# EAGLE design BartendingRobotPCB (EAGLE 9.6.2)
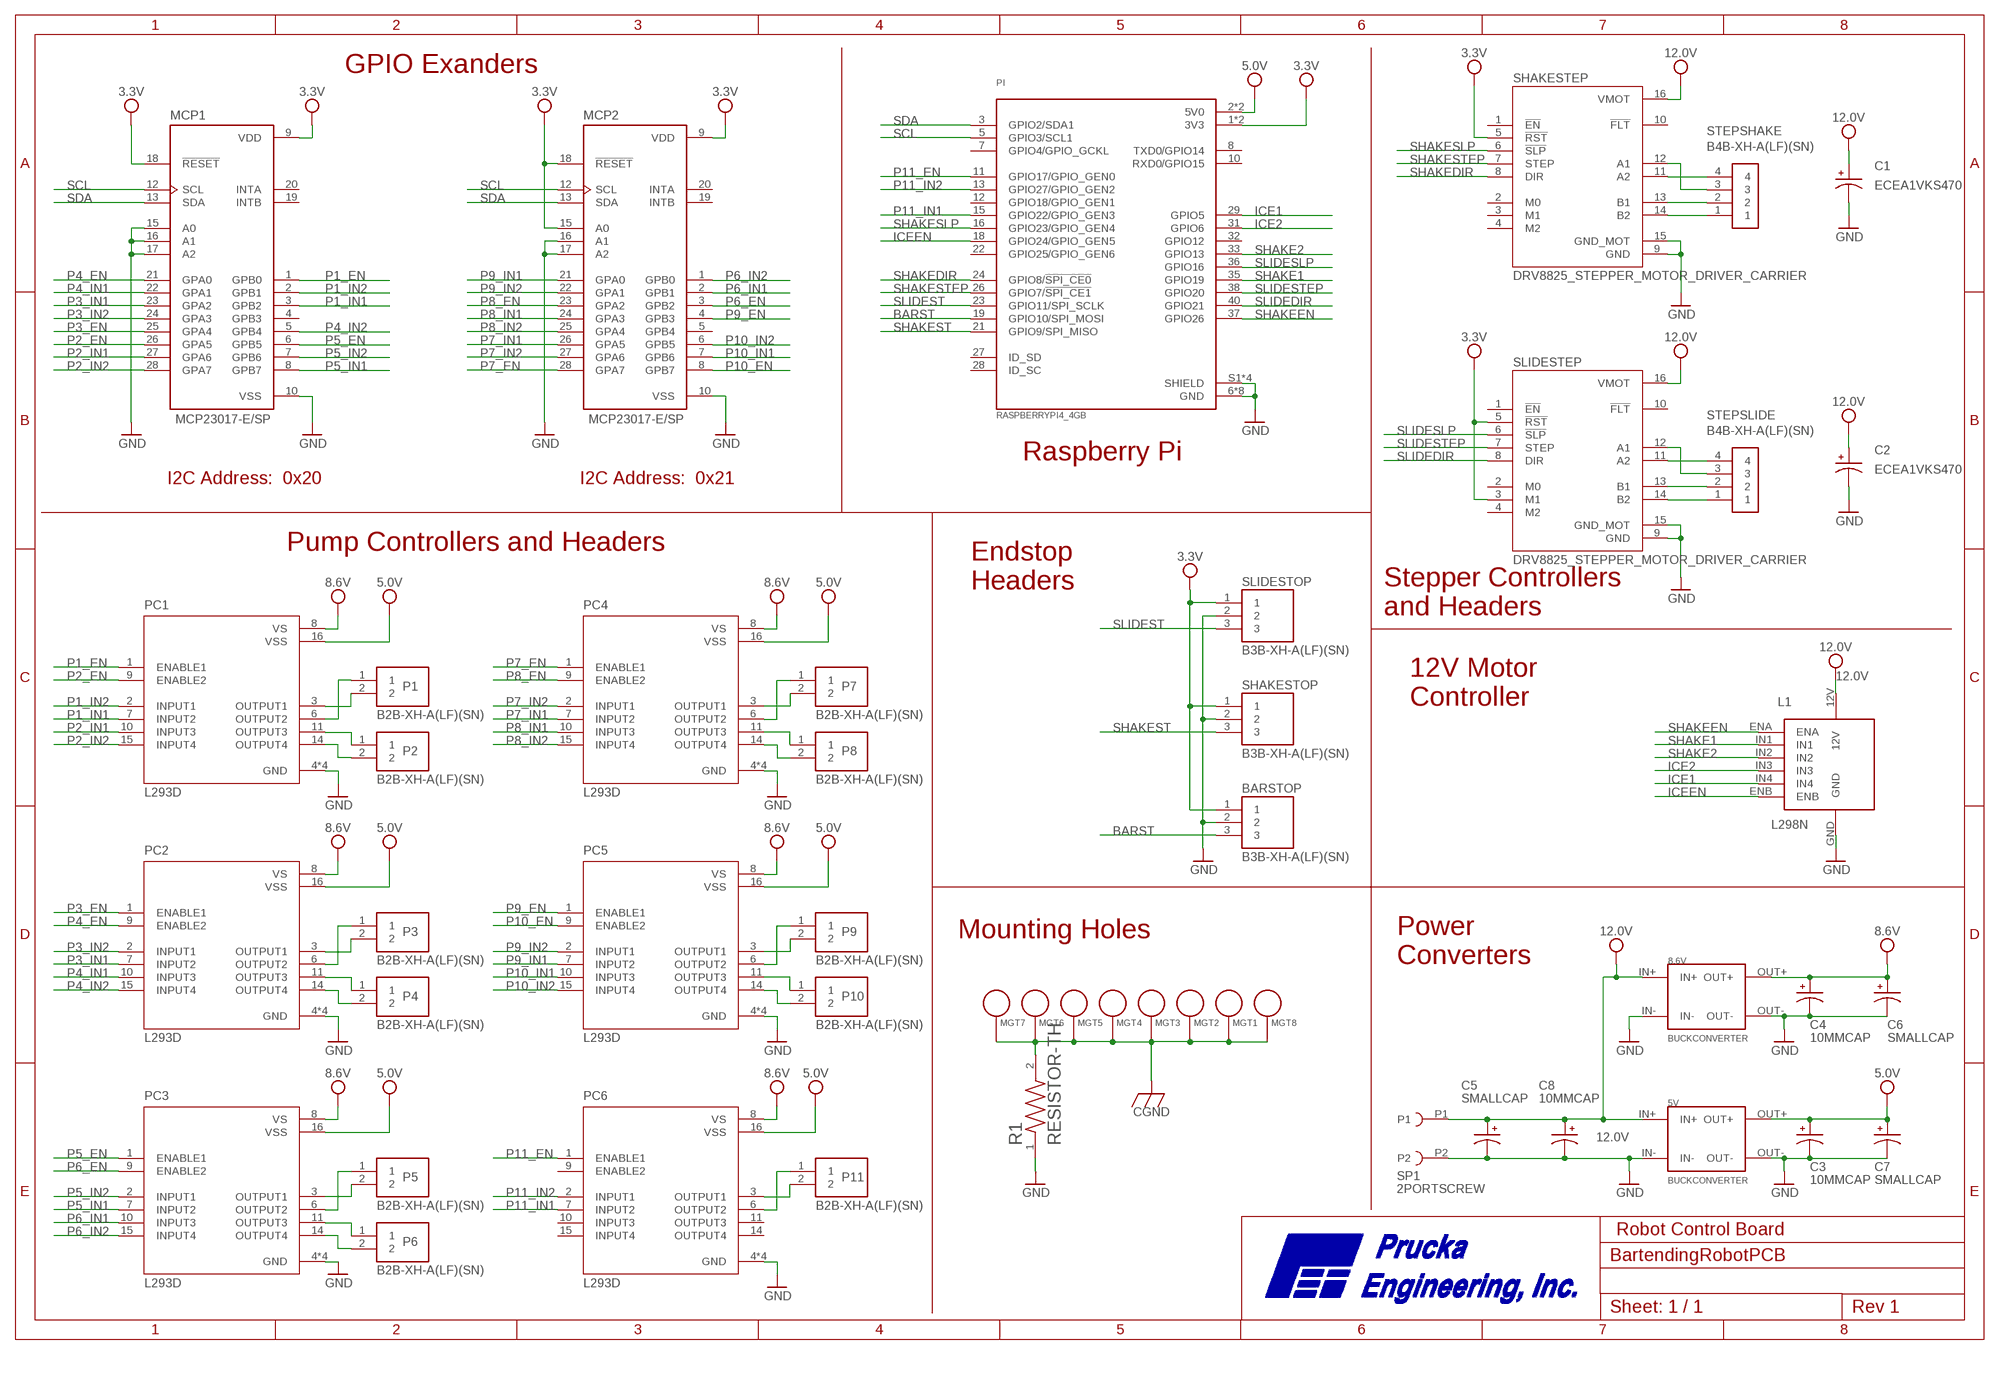
[diagram p0: schematic, sheet 1]

## Parts
5V  BUCKCONVERTER  [BUCKCONVERTER]
8.6V  BUCKCONVERTER  [BUCKCONVERTER]
BARSTOP  B3B-XH-A(LF)(SN)  [JST_B3B-XH-A(LF)(SN)]
C1  ECEA1VKS470  [CAPPRD250W45D800H500]
C2  ECEA1VKS470  [CAPPRD250W45D800H500]
C3  10MMCAP  [10MMCAP]
C4  10MMCAP  [10MMCAP]
C5  SMALLCAP  [SMALLCAP]
C6  SMALLCAP  [SMALLCAP]
C7  SMALLCAP  [SMALLCAP]
C8  10MMCAP  [10MMCAP]
L1  L298N  [L298N]
MCP1  MCP23017-E/SP  [DIP787W45P254L3556H508Q28]
MCP2  MCP23017-E/SP  [DIP787W45P254L3556H508Q28]
MGT1  MOUNTING_HOLE  [MOUNTING_HOLE]
MGT2  MOUNTING_HOLE  [MOUNTING_HOLE]
MGT3  MOUNTING_HOLE  [MOUNTING_HOLE]
MGT4  MOUNTING_HOLE  [MOUNTING_HOLE]
MGT5  MOUNTING_HOLE  [MOUNTING_HOLE]
MGT6  MOUNTING_HOLE  [MOUNTING_HOLE]
MGT7  MOUNTING_HOLE  [MOUNTING_HOLE]
MGT8  MOUNTING_HOLE  [MOUNTING_HOLE]
P1  B2B-XH-A(LF)(SN)  [JST_B2B-XH-A(LF)(SN)]
P2  B2B-XH-A(LF)(SN)  [JST_B2B-XH-A(LF)(SN)]
P3  B2B-XH-A(LF)(SN)  [JST_B2B-XH-A(LF)(SN)]
P4  B2B-XH-A(LF)(SN)  [JST_B2B-XH-A(LF)(SN)]
P5  B2B-XH-A(LF)(SN)  [JST_B2B-XH-A(LF)(SN)]
P6  B2B-XH-A(LF)(SN)  [JST_B2B-XH-A(LF)(SN)]
P7  B2B-XH-A(LF)(SN)  [JST_B2B-XH-A(LF)(SN)]
P8  B2B-XH-A(LF)(SN)  [JST_B2B-XH-A(LF)(SN)]
P9  B2B-XH-A(LF)(SN)  [JST_B2B-XH-A(LF)(SN)]
P10  B2B-XH-A(LF)(SN)  [JST_B2B-XH-A(LF)(SN)]
P11  B2B-XH-A(LF)(SN)  [JST_B2B-XH-A(LF)(SN)]
PC1  L293D  [DIP880W50P254L2000H510Q16]
PC2  L293D  [DIP880W50P254L2000H510Q16]
PC3  L293D  [DIP880W50P254L2000H510Q16]
PC4  L293D  [DIP880W50P254L2000H510Q16]
PC5  L293D  [DIP880W50P254L2000H510Q16]
PC6  L293D  [DIP880W50P254L2000H510Q16]
PI  RASPBERRYPI4_4GB  [MODULE_RASPBERRYPI4_4GB]
R1  RESISTOR-TH  [RESAD700W45L350D185]
SHAKESTEP  DRV8825_STEPPER_MOTOR_DRIVER_CARRIER  [IC_DRV8825_STEPPER_MOTOR_DRIVER_CARRIER]
SHAKESTOP  B3B-XH-A(LF)(SN)  [JST_B3B-XH-A(LF)(SN)]
SLIDESTEP  DRV8825_STEPPER_MOTOR_DRIVER_CARRIER  [IC_DRV8825_STEPPER_MOTOR_DRIVER_CARRIER]
SLIDESTOP  B3B-XH-A(LF)(SN)  [JST_B3B-XH-A(LF)(SN)]
SP1  2PORTSCREW  [2PORTSCREW]
STEPSHAKE  B4B-XH-A(LF)(SN)  [JST_B4B-XH-A(LF)(SN)]
STEPSLIDE  B4B-XH-A(LF)(SN)  [JST_B4B-XH-A(LF)(SN)]

## Nets
3.3V: BARSTOP.1 MCP1.9(VDD) MCP1.18(!RESET) MCP2.9(VDD) MCP2.15(A0) MCP2.18(!RESET) PI.1(3V3) PI.17(3V3) SHAKESTEP.5(!RST) SHAKESTOP.1 SLIDESTEP.3(M1) SLIDESTEP.5(!RST) SLIDESTOP.1
5.0V: 5V.OUT+ C3.+(P) C7.+(P) PC1.16(VSS) PC2.16(VSS) PC3.16(VSS) PC4.16(VSS) PC5.16(VSS) PC6.16(VSS) PI.2(5V0) PI.4(5V0)
8.6V: 8.6V.OUT+ C4.+(P) C6.+(P) PC1.8(VS) PC2.8(VS) PC3.8(VS) PC4.8(VS) PC5.8(VS) PC6.8(VS)
12.0V: 5V.IN+ 8.6V.IN+ C1.P C2.P C5.+(P) C8.+(P) L1.12V SHAKESTEP.16(VMOT) SLIDESTEP.16(VMOT) SP1.P1
BARST: BARSTOP.3 PI.19(GPIO10/SPI_MOSI)
CGND: MGT1.P$1 MGT2.P$1 MGT3.P$1 MGT4.P$1 MGT5.P$1 MGT6.P$1 MGT7.P$1 MGT8.P$1 R1.2
GND: 5V.IN- 5V.OUT- 8.6V.IN- 8.6V.OUT- BARSTOP.2 C1.N C2.N C3.-(N) C4.-(N) C5.-(N) C6.-(N) C7.-(N) C8.-(N) L1.GND MCP1.10(VSS) MCP1.15(A0) MCP1.16(A1) MCP1.17(A2) MCP2.10(VSS) MCP2.16(A1) MCP2.17(A2) PC1.4(GND) PC1.5(GND) PC1.12(GND) PC1.13(GND) PC2.4(GND) PC2.5(GND) PC2.12(GND) PC2.13(GND) PC3.4(GND) PC3.5(GND) PC3.12(GND) PC3.13(GND) PC4.4(GND) PC4.5(GND) PC4.12(GND) PC4.13(GND) PC5.4(GND) PC5.5(GND) PC5.12(GND) PC5.13(GND) PC6.4(GND) PC6.5(GND) PC6.12(GND) PC6.13(GND) PI.6(GND) PI.9(GND) PI.14(GND) PI.20(GND) PI.25(GND) PI.30(GND) PI.34(GND) PI.39(GND) PI.S1(SHIELD) PI.S2(SHIELD) PI.S3(SHIELD) PI.S4(SHIELD) R1.1 SHAKESTEP.9(GND) SHAKESTEP.15(GND_MOT) SHAKESTOP.2 SLIDESTEP.9(GND) SLIDESTEP.15(GND_MOT) SLIDESTOP.2 SP1.P2
ICE1: L1.IN4 PI.29(GPIO5)
ICE2: L1.IN3 PI.31(GPIO6)
ICEEN: L1.ENB PI.18(GPIO24/GPIO_GEN5)
N$1: SHAKESTEP.14(B2) STEPSHAKE.1
N$2: SHAKESTEP.13(B1) STEPSHAKE.2
N$3: SHAKESTEP.11(A2) STEPSHAKE.4
N$4: SHAKESTEP.12(A1) STEPSHAKE.3
N$5: SLIDESTEP.14(B2) STEPSLIDE.1
N$6: SLIDESTEP.13(B1) STEPSLIDE.2
N$7: SLIDESTEP.11(A2) STEPSLIDE.4
N$8: SLIDESTEP.12(A1) STEPSLIDE.3
N$9: P3.1 PC2.6(OUTPUT2)
N$10: P3.2 PC2.3(OUTPUT1)
N$11: P7.1 PC4.6(OUTPUT2)
N$12: P7.2 PC4.3(OUTPUT1)
N$13: P2.1 PC1.11(OUTPUT3)
N$14: P2.2 PC1.14(OUTPUT4)
N$15: P9.1 PC5.6(OUTPUT2)
N$16: P9.2 PC5.3(OUTPUT1)
N$17: P4.1 PC2.11(OUTPUT3)
N$18: P4.2 PC2.14(OUTPUT4)
N$19: P11.1 PC6.6(OUTPUT2)
N$20: P11.2 PC6.3(OUTPUT1)
N$21: P5.1 PC3.6(OUTPUT2)
N$22: P6.1 PC3.11(OUTPUT3)
N$23: P6.2 PC3.14(OUTPUT4)
N$24: P5.2 PC3.3(OUTPUT1)
N$25: P1.1 PC1.6(OUTPUT2)
N$26: P1.2 PC1.3(OUTPUT1)
N$27: P10.2 PC5.14(OUTPUT4)
N$30: P10.1 PC5.11(OUTPUT3)
N$33: P8.2 PC4.14(OUTPUT4)
N$34: P8.1 PC4.11(OUTPUT3)
P1_EN: MCP1.1(GPB0) PC1.1(ENABLE1)
P1_IN1: MCP1.3(GPB2) PC1.7(INPUT2)
P1_IN2: MCP1.2(GPB1) PC1.2(INPUT1)
P2_EN: MCP1.26(GPA5) PC1.9(ENABLE2)
P2_IN1: MCP1.27(GPA6) PC1.10(INPUT3)
P2_IN2: MCP1.28(GPA7) PC1.15(INPUT4)
P3_EN: MCP1.25(GPA4) PC2.1(ENABLE1)
P3_IN1: MCP1.23(GPA2) PC2.7(INPUT2)
P3_IN2: MCP1.24(GPA3) PC2.2(INPUT1)
P4_EN: MCP1.21(GPA0) PC2.9(ENABLE2)
P4_IN1: MCP1.22(GPA1) PC2.10(INPUT3)
P4_IN2: MCP1.5(GPB4) PC2.15(INPUT4)
P5_EN: MCP1.6(GPB5) PC3.1(ENABLE1)
P5_IN1: MCP1.8(GPB7) PC3.7(INPUT2)
P5_IN2: MCP1.7(GPB6) PC3.2(INPUT1)
P6_EN: MCP2.3(GPB2) PC3.9(ENABLE2)
P6_IN1: MCP2.2(GPB1) PC3.10(INPUT3)
P6_IN2: MCP2.1(GPB0) PC3.15(INPUT4)
P7_EN: MCP2.28(GPA7) PC4.1(ENABLE1)
P7_IN1: MCP2.26(GPA5) PC4.7(INPUT2)
P7_IN2: MCP2.27(GPA6) PC4.2(INPUT1)
P8_EN: MCP2.23(GPA2) PC4.9(ENABLE2)
P8_IN1: MCP2.24(GPA3) PC4.10(INPUT3)
P8_IN2: MCP2.25(GPA4) PC4.15(INPUT4)
P9_EN: MCP2.4(GPB3) PC5.1(ENABLE1)
P9_IN1: MCP2.21(GPA0) PC5.7(INPUT2)
P9_IN2: MCP2.22(GPA1) PC5.2(INPUT1)
P10_EN: MCP2.8(GPB7) PC5.9(ENABLE2)
P10_IN1: MCP2.7(GPB6) PC5.10(INPUT3)
P10_IN2: MCP2.6(GPB5) PC5.15(INPUT4)
P11_EN: PC6.1(ENABLE1) PI.11(GPIO17/GPIO_GEN0)
P11_IN1: PC6.7(INPUT2) PI.15(GPIO22/GPIO_GEN3)
P11_IN2: PC6.2(INPUT1) PI.13(GPIO27/GPIO_GEN2)
SCL: MCP1.12(SCL) MCP2.12(SCL) PI.5(GPIO3/SCL1)
SDA: MCP1.13(SDA) MCP2.13(SDA) PI.3(GPIO2/SDA1)
SHAKE1: L1.IN1 PI.35(GPIO19)
SHAKE2: L1.IN2 PI.33(GPIO13)
SHAKEDIR: PI.24(GPIO8/!SPI_CE0!) SHAKESTEP.8(DIR)
SHAKEEN: L1.ENA PI.37(GPIO26)
SHAKESLP: PI.16(GPIO23/GPIO_GEN4) SHAKESTEP.6(!SLP)
SHAKEST: PI.21(GPIO9/SPI_MISO) SHAKESTOP.3
SHAKESTEP: PI.26(GPIO7/!SPI_CE1!) SHAKESTEP.7(STEP)
SLIDEDIR: PI.40(GPIO21) SLIDESTEP.8(DIR)
SLIDESLP: PI.36(GPIO16) SLIDESTEP.6(!SLP)
SLIDEST: PI.23(GPIO11/SPI_SCLK) SLIDESTOP.3
SLIDESTEP: PI.38(GPIO20) SLIDESTEP.7(STEP)
Unconnected: MCP1.4(GPB3) MCP1.19(INTB) MCP1.20(INTA) MCP2.5(GPB4) MCP2.19(INTB) MCP2.20(INTA) PC6.9(ENABLE2) PC6.10(INPUT3) PC6.11(OUTPUT3) PC6.14(OUTPUT4) PC6.15(INPUT4) PI.7(GPIO4/GPIO_GCKL) PI.8(TXD0/GPIO14) PI.10(RXD0/GPIO15) PI.12(GPIO18/GPIO_GEN1) PI.22(GPIO25/GPIO_GEN6) PI.27(ID_SD) PI.28(ID_SC) PI.32(GPIO12) SHAKESTEP.1(!EN) SHAKESTEP.2(M0) SHAKESTEP.3(M1) SHAKESTEP.4(M2) SHAKESTEP.10(!FLT) SLIDESTEP.1(!EN) SLIDESTEP.2(M0) SLIDESTEP.4(M2) SLIDESTEP.10(!FLT)

## Notes on the sheet
- GPIO Exanders
- Raspberry Pi
- I2C Address:  0x20 | I2C Address:  0x21
- Pump Controllers and Headers
- Endstop 
  Headers
- Stepper Controllers 
  and Headers
- 12V Motor 
  Controller
- Mounting Holes
- Power 
  Converters
- Robot Control Board
- 1 / 1
- C:/Temp/PEI Logo.bmp
- C:/Temp/PEI Logo.bmp

## Library data of the parts
5V 8.6V = BartendingRobot:BUCKCONVERTER: Pin layout for a high amperage buck converter
BARSTOP SHAKESTOP SLIDESTOP = BartendingRobot:B3B-XH-A(LF)(SN): Connector Header Through Hole 3 position 0.098" (2.50mm) Check prices <https://pricing.snapeda.com/parts/B3B-XH-A%28LF%29%28SN%29/JST%20Sales/view-part?ref=eda>; AVAILABILITY: In Stock; DESCRIPTION: Connector Header Through Hole 3 position 0.098 (2.50mm); MF: JST Sales; MP: B3B-XH-A(LF)(SN); PACKAGE: None; PRICE: None
C1 C2 = BartendingRobot:ECEA1VKS470: KS-A; A_MAX: 5; B_MAX: 0.5; B_NOM: 0.45; DESCRIPTION: KS-A; D_NOM: 8; E_NOM: 2.5; MF: PANASONIC; PARTREV: 28-FEB-20
C3 C4 C8 = BartendingRobot:10MMCAP
C5-C7 = BartendingRobot:SMALLCAP
L1 = BartendingRobot:L298N: Mounting for L298N board and logic pins
MCP1 MCP2 = BartendingRobot:MCP23017-E/SP: MCP23017 Series 5.5 V 1.7 MHz SMT 16-Bit I2C I/O Expander - SPDIP-28; MF: Microchip; PARTREV: C; STANDARD: IPC-7251
MGT1-MGT8 = BartendingRobot:MOUNTING_HOLE: Chassis Mounting Hole w/GND connection ability
P1-P11 = BartendingRobot:B2B-XH-A(LF)(SN): Connector Header Through Hole 2 position 0.098" (2.50mm) Check prices <https://pricing.snapeda.com/parts/B2B-XH-A%28LF%29%28SN%29/JST%20Sales/view-part?ref=eda>; AVAILABILITY: In Stock; DESCRIPTION: Connector Header Through Hole 2 position 0.098 (2.50mm); MF: JST Sales; MP: B2B-XH-A(LF)(SN); PACKAGE: None; PRICE: None
PC1-PC6 = BartendingRobot:L293D: 4-Channel Motor Driver 24V 16-Pin Power PDIP Tube; A_MAX: 5.1; A_MIN: 5.1; A_NOM: 5.1; B_MAX: 0.5; B_MIN: 0.5; B_NOM: 0.5; D_MAX: 20.0; D_MIN: 20.0; D_NOM: 20.0; E1_MAX: 7.1; E1_MIN: 7.1; E1_NOM: 7.1; ENOM: 2.54; E_NOM: 8.8; MANUFACTURER: ST Microelectronics; MAXIMUM_PACKAGE_HEIGHT: 5.1mm; PIN_COUNT: 16.0; STANDARD: IPC 7351B
PI = BartendingRobot:RASPBERRYPI4_4GB: BCM2835 Raspberry Pi Model B+ - ARM11, VideoCore MPU Embedded Evaluation Board; MANUFACTURER: Raspberry Pi; MAXIMUM_PACKAGE_HIEGHT: 18mm; PARTREV: 1.0; STANDARD: Manufacturer Recommendations
R1 = BartendingRobot:RESISTOR-TH: CFR16 5% 10K; MANUFACTURER: TE Connectivity; MAXIMUM_PACKAGE_HEIGHT: 3.85mm; PARTREV: BA; STANDARD: Manufacturer Recommendations
SHAKESTEP SLIDESTEP = BartendingRobot:DRV8825_STEPPER_MOTOR_DRIVER_CARRIER: Stepper motor controler; IC: DRV8825; 1.5A; Uin mot: 8.2÷45V; AVAILABILITY: Unavailable; DESCRIPTION: Stepper motor controler; IC: DRV8825; 1.5A; Uin mot: 8.2÷45V; MF: Pololu; MP: DRV8825 STEPPER MOTOR DRIVER CARRIER; PACKAGE: None; PRICE: None
SP1 = BartendingRobot:2PORTSCREW: 2 port screw terminal to connect high power wires to a PCB
STEPSHAKE STEPSLIDE = BartendingRobot:B4B-XH-A(LF)(SN): XH Series 4 Position 2.5 mm Pitch Through Hole Crimp Top Entry Shrouded Header; MANUFACTURER: JST Sales America Inc; PARTREV: NA; STANDARD: Manufacturer Recommendation

## Board
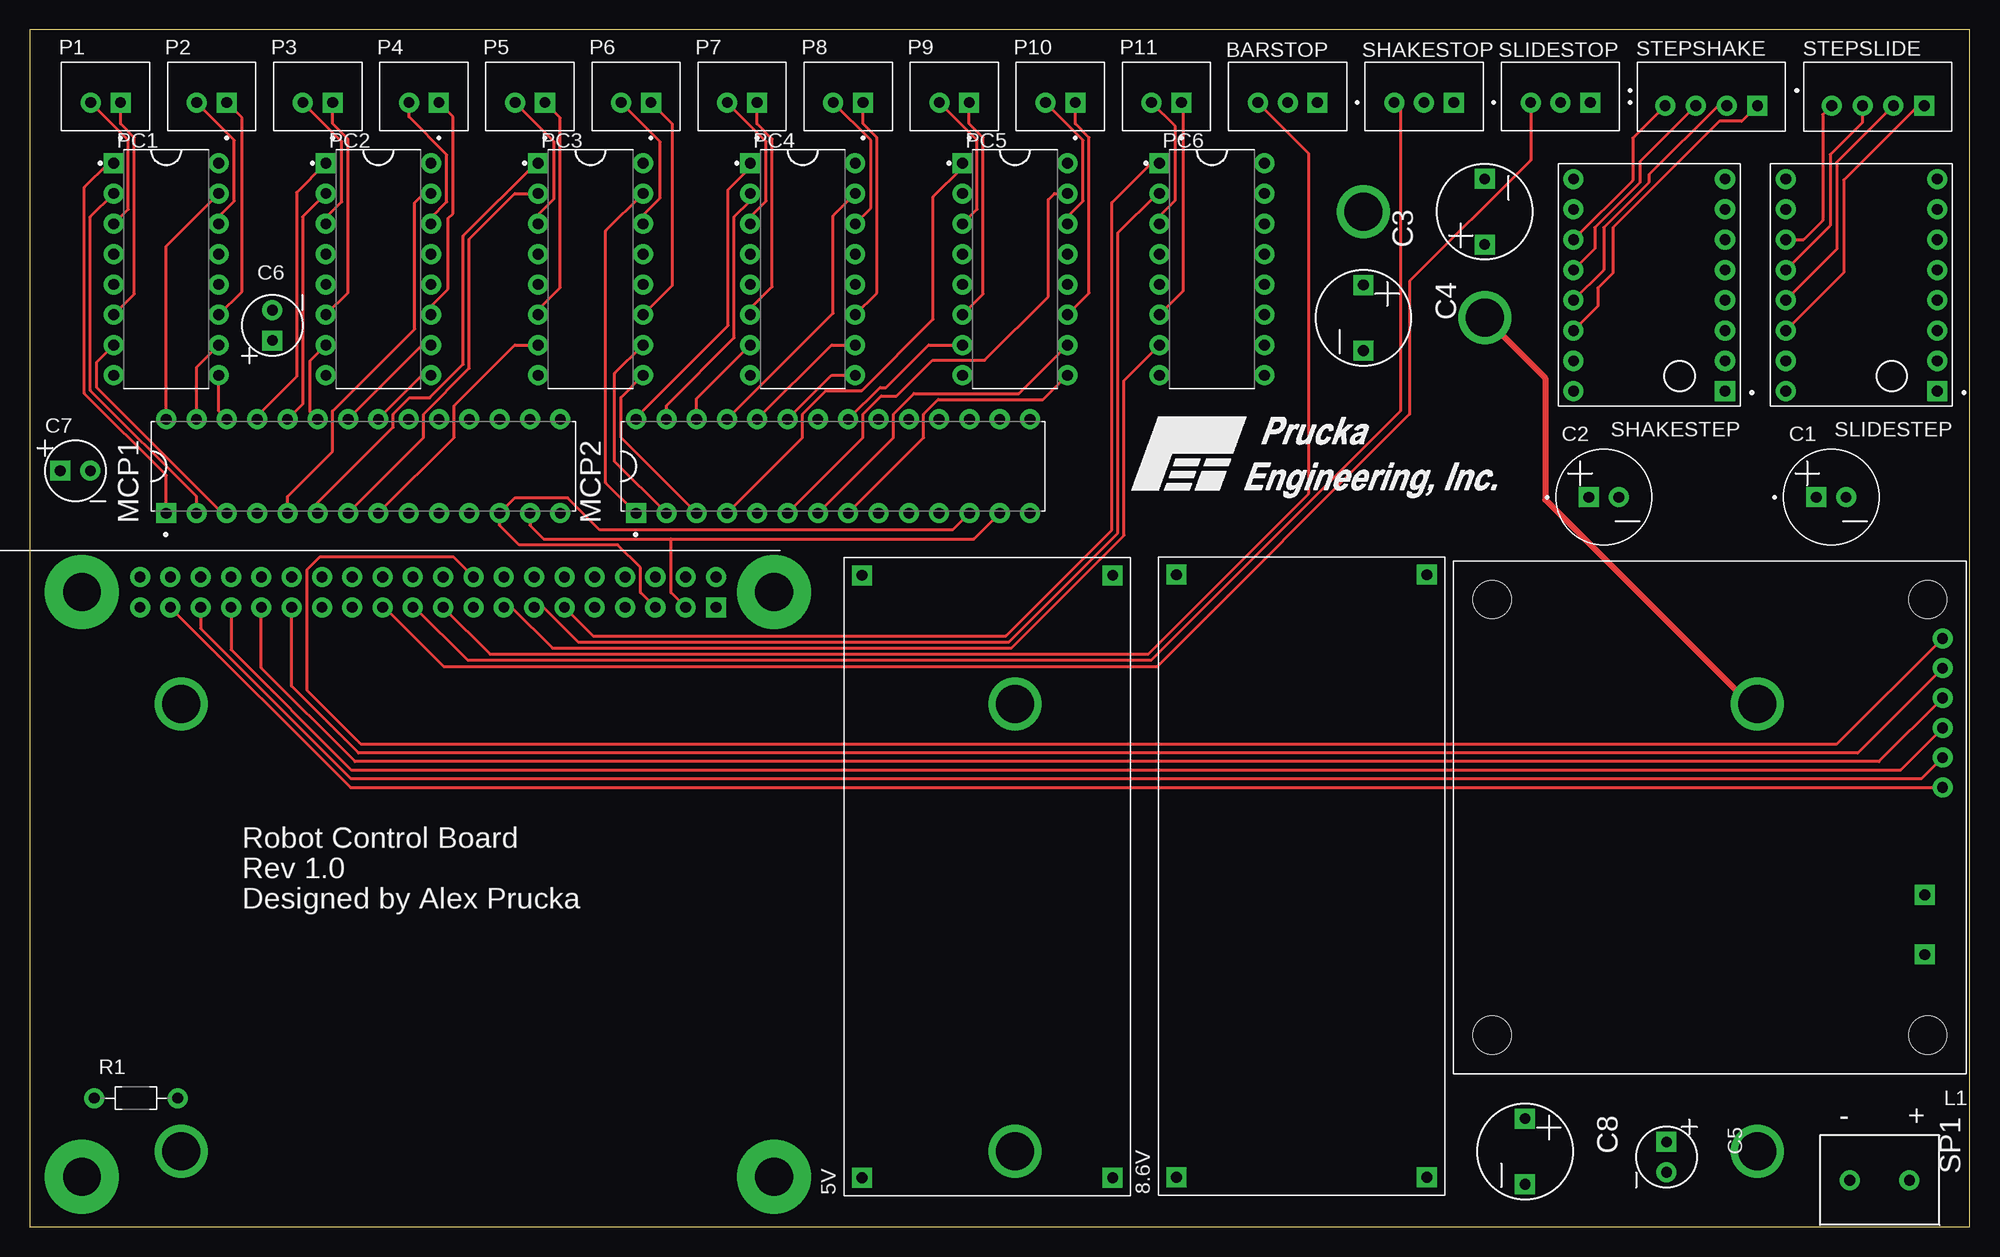
[diagram p1: board, top side]
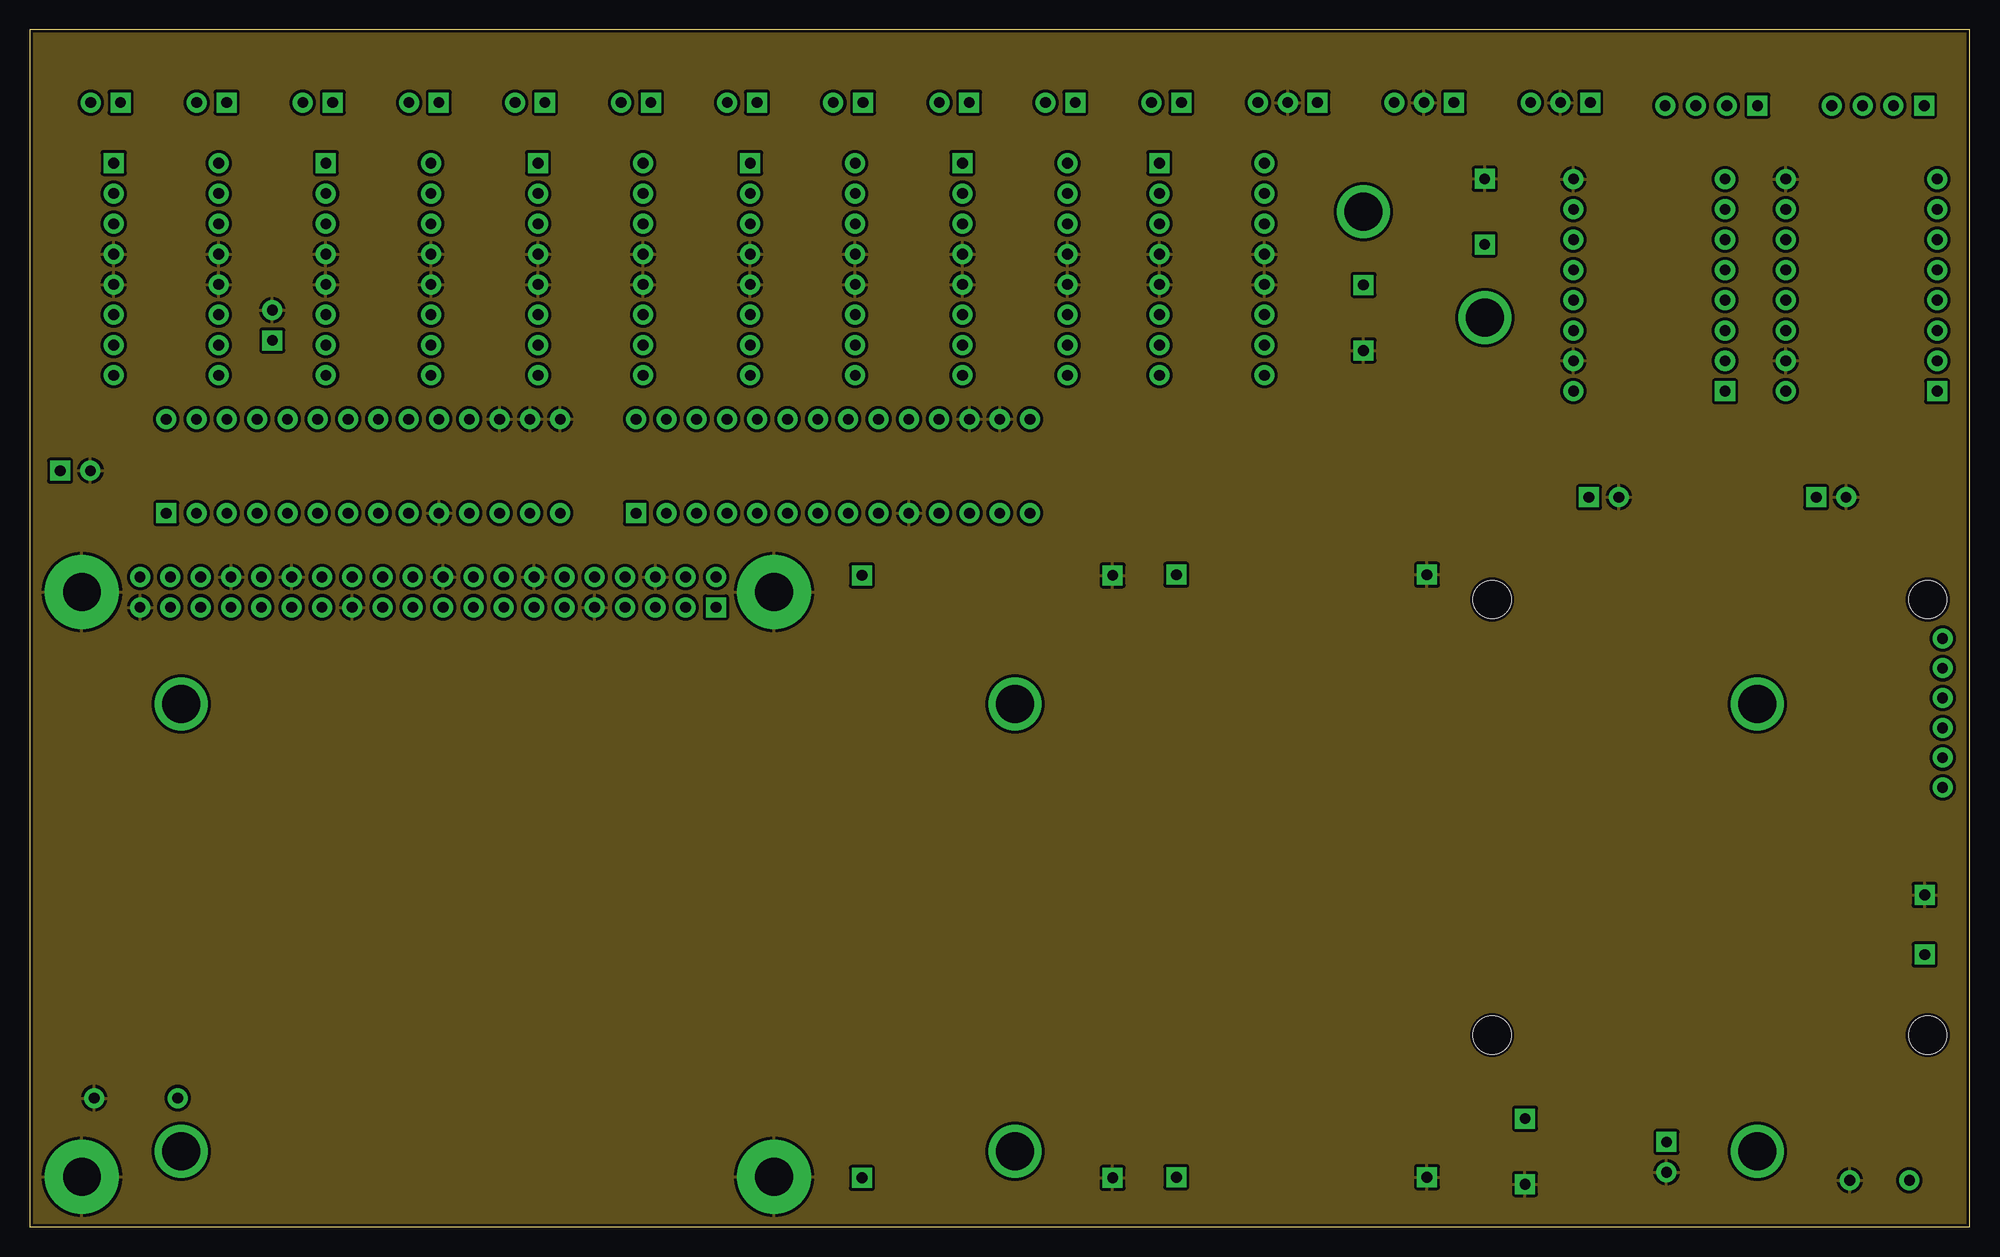
[diagram p2: board, inner layer Route2]
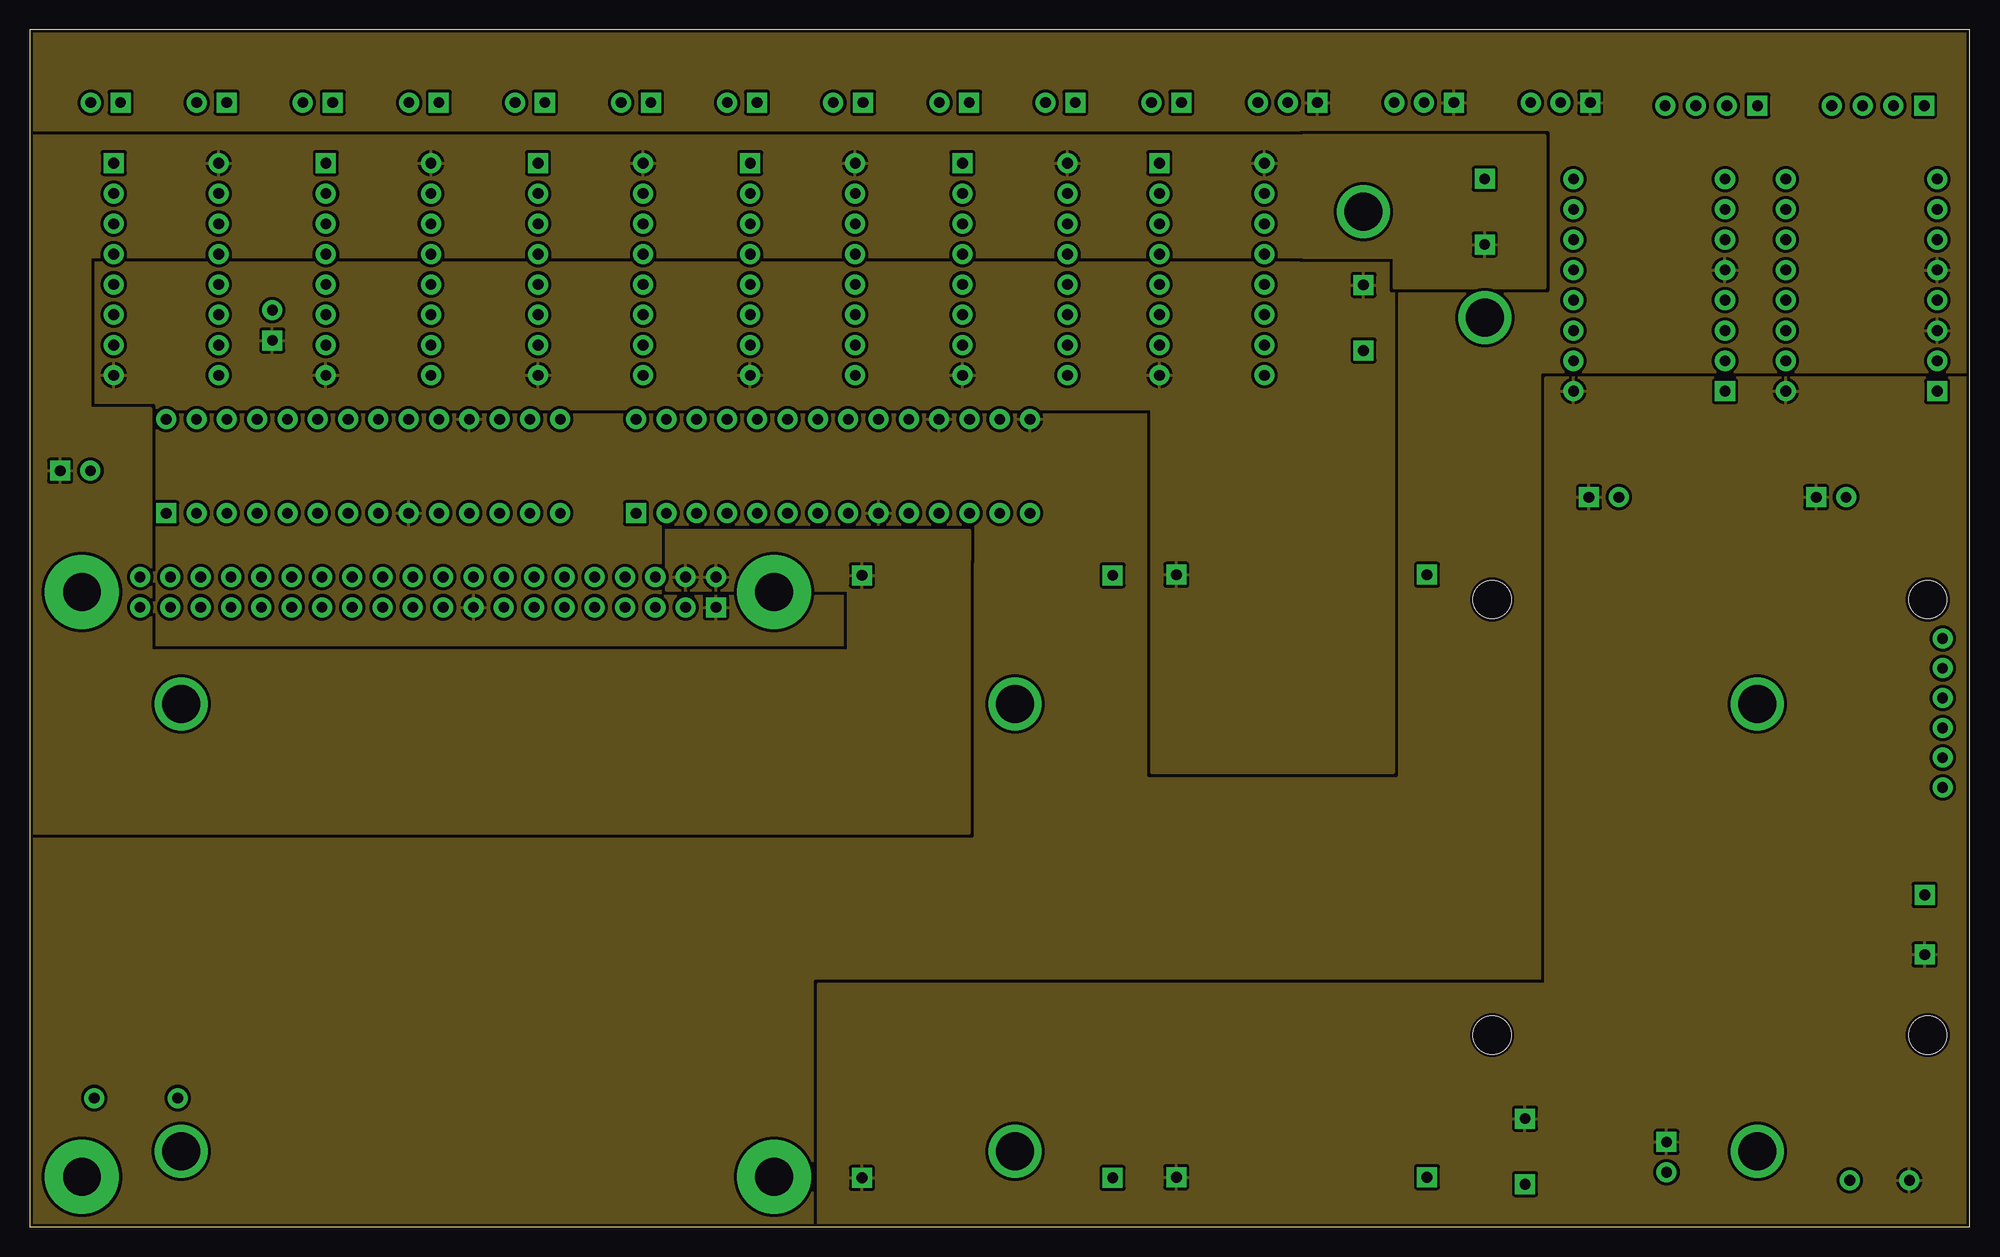
[diagram p3: board, inner layer Route15]
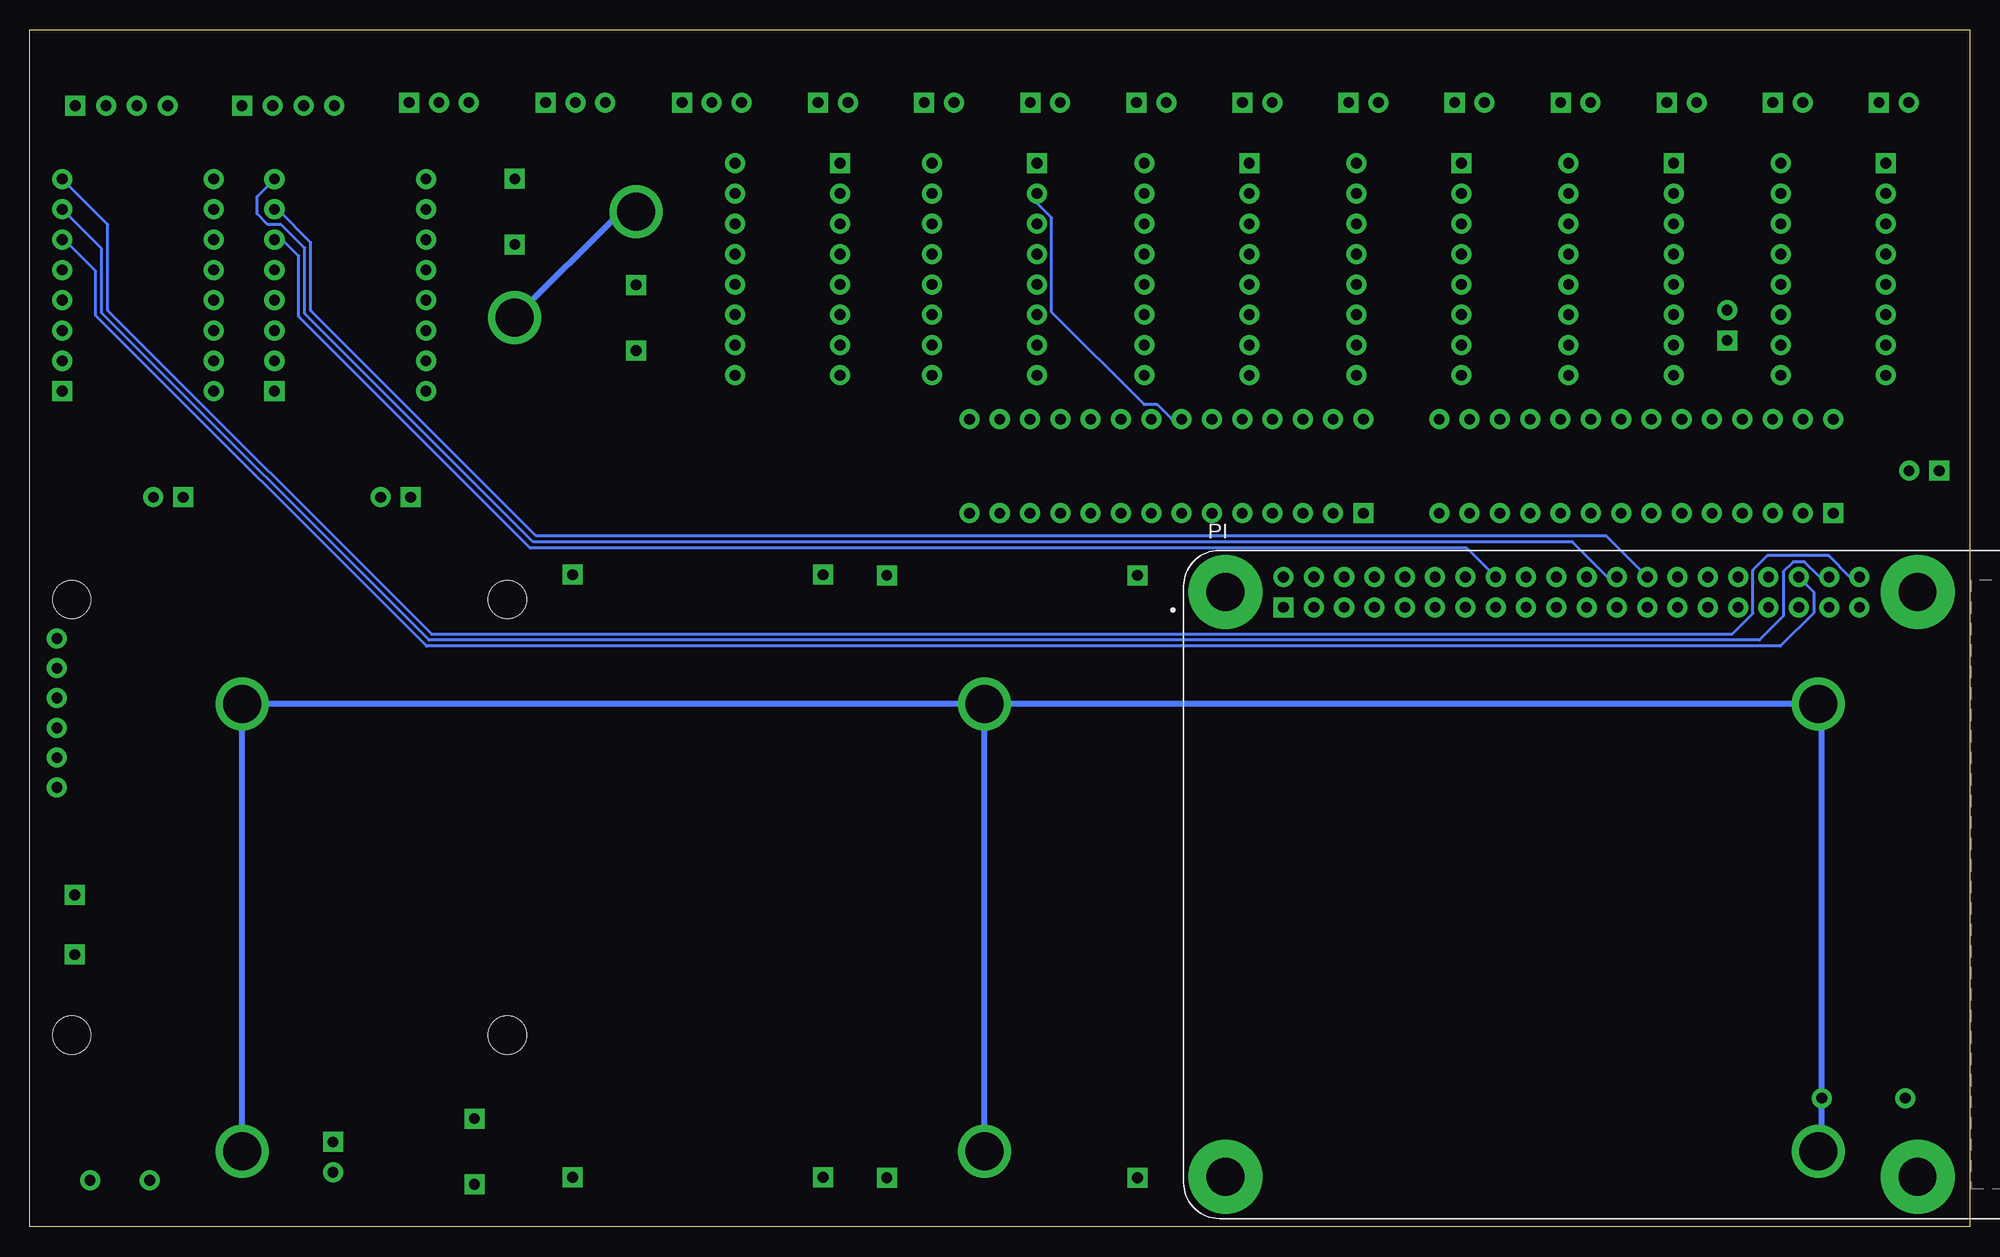
[diagram p4: board, bottom side, seen from below]

Size 162.56 x 100.33 mm. Coordinates in mm from the lower left corner, seen from the top.
Outline: 0,0 162.56,0 162.56,100.33 0,100.33 0,0
Copper layers (1*2*15*16): Top 0.035mm / dielectric 0.23mm / Route2 0.035mm / dielectric 0.93mm / Route15 0.035mm / dielectric 0.23mm / Bottom 0.035mm
Design rules "ENGI301_4lyr": minimum track width 10mil, minimum drill 12mil, track to track 10mil, track to pad 10mil, pad to pad 10mil, via to via 10mil, smd to smd 10mil, copper to edge 10mil, drill to drill 12mil, minimum pad ring 6mil, minimum via ring 6mil, stop-mask expansion 3mil, vias tented up to drill 25mil, thermal gap 10mil

### Footprints (pad centres in the part's own frame; a part is rotated, then mirrored left to right if it is on the bottom)
BUCKCONVERTER = drill 0.9 pad 1.676 square: IN+ -25.25,10.5; IN- -25.25,-10.5; OUT+ 25.25,10.5; OUT- 25.25,-10.5
JST_B3B-XH-A(LF)(SN) = drill 0.9 pad 1.676 square: 1 2.5,0 | drill 0.9 pad 1.676: 2 0,0; 3 -2.5,0
CAPPRD250W45D800H500 = drill 0.9 pad 1.676: N 1.25,0 | drill 0.9 pad 1.676 square: P -1.25,0
10MMCAP = drill 0.9 pad 1.676 square: + -2.75,0; - 2.75,0
SMALLCAP = drill 0.9 pad 1.676 square: + -1.27,0 | drill 0.9 pad 1.676: - 1.27,0
L298N = drill 0.9 pad 1.676 square: 12V -18,11.5; GND -18,6.5 | drill 0.9 pad 1.676: ENA -19.5,-2.5; ENB -19.5,-15; IN1 -19.5,-5; IN2 -19.5,-7.5; IN3 -19.5,-10; IN4 -19.5,-12.5 | hole 3.175: -18.25,-18.25; 18.25,-18.25; 18.25,18.25; -18.25,18.25
DIP787W45P254L3556H508Q28 = drill 0.9 pad 1.676 square: 1 -3.935,16.51 | drill 0.9 pad 1.676: 2 -3.935,13.97; 3 -3.935,11.43; 4 -3.935,8.89; 5 -3.935,6.35; 6 -3.935,3.81; 7 -3.935,1.27; 8 -3.935,-1.27; 9 -3.935,-3.81; 10 -3.935,-6.35; 11 -3.935,-8.89; 12 -3.935,-11.43; 13 -3.935,-13.97; 14 -3.935,-16.51; 15 3.935,-16.51; 16 3.935,-13.97; 17 3.935,-11.43; 18 3.935,-8.89; 19 3.935,-6.35; 20 3.935,-3.81; 21 3.935,-1.27; 22 3.935,1.27; 23 3.935,3.81; 24 3.935,6.35; 25 3.935,8.89; 26 3.935,11.43; 27 3.935,13.97; 28 3.935,16.51
MOUNTING_HOLE = drill 3.175 pad 4.445: P$1 0,0
JST_B2B-XH-A(LF)(SN) = drill 0.9 pad 1.676 square: 1 1.25,0 | drill 0.9 pad 1.676: 2 -1.25,0
DIP880W50P254L2000H510Q16 = drill 0.9 pad 1.676 square: 1 -4.4,8.89 | drill 0.9 pad 1.676: 2 -4.4,6.35; 3 -4.4,3.81; 4 -4.4,1.27; 5 -4.4,-1.27; 6 -4.4,-3.81; 7 -4.4,-6.35; 8 -4.4,-8.89; 9 4.4,-8.89; 10 4.4,-6.35; 11 4.4,-3.81; 12 4.4,-1.27; 13 4.4,1.27; 14 4.4,3.81; 15 4.4,6.35; 16 4.4,8.89
MODULE_RASPBERRYPI4_4GB = drill 0.9 pad 1.676 square: 1 -34.13,23.23 | drill 0.9 pad 1.676: 2 -34.13,25.77; 3 -31.59,23.23; 4 -31.59,25.77; 5 -29.05,23.23; 6 -29.05,25.77; 7 -26.51,23.23; 8 -26.51,25.77; 9 -23.97,23.23; 10 -23.97,25.77; 11 -21.43,23.23; 12 -21.43,25.77; 13 -18.89,23.23; 14 -18.89,25.77; 15 -16.35,23.23; 16 -16.35,25.77; 17 -13.81,23.23; 18 -13.81,25.77; 19 -11.27,23.23; 20 -11.27,25.77; 21 -8.73,23.23; 22 -8.73,25.77; 23 -6.19,23.23; 24 -6.19,25.77; 25 -3.65,23.23; 26 -3.65,25.77; 27 -1.11,23.23; 28 -1.11,25.77; 29 1.43,23.23; 30 1.43,25.77; 31 3.97,23.23; 32 3.97,25.77; 33 6.51,23.23; 34 6.51,25.77; 35 9.05,23.23; 36 9.05,25.77; 37 11.59,23.23; 38 11.59,25.77; 39 14.13,23.23; 40 14.13,25.77 | drill 3.175 pad 6.2: S1 -39,24.5; S2 19,24.5; S3 19,-24.5; S4 -39,-24.5
RESAD700W45L350D185 = drill 0.9 pad 1.676: 1 -3.5,0; 2 3.5,0
IC_DRV8825_STEPPER_MOTOR_DRIVER_CARRIER = drill 0.9 pad 1.676 square: 1 -6.35,8.89 | drill 0.9 pad 1.676: 2 -6.35,6.35; 3 -6.35,3.81; 4 -6.35,1.27; 5 -6.35,-1.27; 6 -6.35,-3.81; 7 -6.35,-6.35; 8 -6.35,-8.89; 9 6.35,-8.89; 10 6.35,-6.35; 11 6.35,-3.81; 12 6.35,-1.27; 13 6.35,1.27; 14 6.35,3.81; 15 6.35,6.35; 16 6.35,8.89
2PORTSCREW = drill 0.9 pad 1.676: P1 -2.5,0; P2 2.5,0
JST_B4B-XH-A(LF)(SN) = drill 0.9 pad 1.676 square: 1 7.62,-1.27 | drill 0.9 pad 1.676: 2 5.04,-1.27; 3 2.46,-1.27; 4 -0.12,-1.27

### Placement (x,y rotation side)
5V  80.24,29.36 90 top
8.6V  106.58,29.41 90 top
BARSTOP  105.41,94.23 0 top
C1  150.95,61.16 0 top
C2  131.9,61.16 0 top
C3  121.92,85.09 90 top
C4  111.76,76.2 270 top
C5  137.16,5.84 270 top
C6  20.32,75.56 90 top
C7  3.81,63.37 0 top
C8  125.3,6.32 270 top
L1  140.79,34.33 180 top
MCP1  27.94,63.75 90 top
MCP2  67.31,63.75 90 top
MGT1  12.7,43.81 0 top
MGT2  12.7,6.35 0 top
MGT3  82.55,43.81 0 top
MGT4  82.55,6.35 0 top
MGT5  144.78,43.81 0 top
MGT6  144.78,6.35 0 top
MGT7  111.76,85.09 0 top
MGT8  121.92,76.2 0 top
P1  6.35,94.23 0 top
P2  15.24,94.23 0 top
P3  24.13,94.23 0 top
P4  33.02,94.23 0 top
P5  41.91,94.23 0 top
P6  50.8,94.23 0 top
P7  59.69,94.23 0 top
P8  68.58,94.23 0 top
P9  77.47,94.23 0 top
P10  86.36,94.23 0 top
P11  95.25,94.23 0 top
PC1  11.43,80.26 0 top
PC2  29.21,80.26 0 top
PC3  46.99,80.26 0 top
PC4  64.77,80.26 0 top
PC5  82.55,80.26 0 top
PC6  99.06,80.26 0 top
PI  23.37,28.7 0 bottom
R1  8.89,10.79 0 top
SHAKESTEP  135.71,78.94 180 top
SHAKESTOP  116.84,94.23 0 top
SLIDESTEP  153.49,78.94 180 top
SLIDESTOP  128.27,94.23 0 top
SP1  155.02,3.91 180 top
STEPSHAKE  137.16,95.25 0 top
STEPSLIDE  151.13,95.25 0 top

### Tracks (layer width: path | path; a pad name or v marks a point on that pad's centre or on a via)
3.3V
  pour Route15 (rank 6): -5.08,106.68 167.64,106.68 167.64,-5.08 -5.08,-5.08
5.0V
  pour Route15: 0,91.44 106.68,91.44 106.68,81.28 0,81.28
  pour Route15: 68.58,55.88 68.58,33.02 78.74,33.02 78.74,55.88
  pour Route15: 127,78.74 127,91.44 106.68,91.44 106.68,81.28 114.3,81.28 114.3,78.74
  pour Route15: 0,81.28 0,33.02 78.74,33.02 78.74,48.26 10.16,48.26 10.16,68.58 5.08,68.58 5.08,81.28
  pour Route15: 53.34,53.34 53.34,58.42 78.74,58.42 78.74,55.88 68.58,55.88 68.58,53.34
8.6V
  pour Route15 (rank 2): 93.98,68.58 93.98,38.1 114.3,38.1 114.3,81.28 5.08,81.28 5.08,68.58
12.0V
  pour Route15: 162.56,0 162.56,71.12 127,71.12 127,20.32 66.04,20.32 66.04,0
BARST
  Top 0.254: PI.19 38.56,48.01 93.73,48.01 107.19,61.47 107.19,89.96 BARSTOP.3
CGND
  Top 0.508: MGT8.P$1 127,71.12 127,60.96 144.15,43.81 MGT5.P$1
  Bottom 0.508: MGT2.P$1 12.39,6.66 R1.2 12.39,43.51 MGT1.P$1 MGT3.P$1 | MGT4.P$1 MGT3.P$1 | MGT3.P$1 MGT5.P$1 MGT6.P$1 | MGT7.P$1 113.03,85.09 MGT8.P$1
GND
  pour Route2 (rank 2): -2.54,104.14 -2.54,-2.54 165.1,-2.54 165.1,104.14
ICE1
  Top 0.254: L1.IN4 153.18,39.71 27.55,39.71 21.94,45.33 PI.29
ICE2
  Top 0.254: L1.IN3 154.96,38.99 27.26,38.99 19.4,46.85 PI.31
ICEEN
  Top 0.254: PI.18 35.52,56.13 24.27,56.13 23.21,55.07 23.21,44.98 27.75,40.44 151.4,40.44 L1.ENB
N$1
  Top 0.254: SHAKESTEP.14 131.39,77.16 131.39,78.68 132.66,79.95 132.66,83.76 141.56,92.66 143.46,92.66 STEPSHAKE.1
N$2
  Top 0.254: SHAKESTEP.13 131.9,80.21 131.9,83.76 135.71,87.57 135.71,88.21 141.48,93.98 STEPSHAKE.2
N$3
  Top 0.254: SHAKESTEP.11 134.32,87.71 134.32,91.26 STEPSHAKE.4
N$4
  Top 0.254: SHAKESTEP.12 131.14,81.98 131.14,83.76 134.95,87.57 134.95,89.31 STEPSHAKE.3
N$5
  Top 0.254: SLIDESTEP.14 151.99,79.98 151.99,87.73 158.24,93.98 STEPSLIDE.1
N$6
  Top 0.254: SLIDESTEP.13 151.42,81.94 151.42,89.23 STEPSLIDE.2
N$7
  Top 0.254: SLIDESTEP.11 148.65,82.75 150.25,84.34 150.25,93.22 STEPSLIDE.4
N$8
  Top 0.254: SLIDESTEP.12 150.87,83.94 150.87,89.86 153.59,92.58 STEPSLIDE.3
N$9
  Top 0.254: P3.1 25.38,92.45 26.66,91.17 26.66,78.3 PC2.6
N$10
  Top 0.254: PC2.3 24.81,84.57 26.15,85.91 26.15,90.97 P3.2
N$11
  Top 0.254: PC4.6 60.37,76.95 62.22,78.8 62.22,91.17 60.94,92.45 P7.1
N$12
  Top 0.254: PC4.3 60.37,84.64 61.71,85.97 61.71,90.97 P7.2
N$13
  Top 0.254: PC1.11 17.78,78.4 17.78,92.94 P2.1
N$14
  Top 0.254: PC1.14 15.83,84.66 17.14,85.98 17.14,91.08 P2.2
N$15
  Top 0.254: P9.1 78.72,92.45 79.88,91.29 79.88,78.19 PC5.6
N$16
  Top 0.254: PC5.3 79.38,85.3 79.38,91.08 P9.2
N$17
  Top 0.254: PC2.11 33.61,77.17 35.05,78.61 35.05,84.53 35.46,84.94 35.46,93.05 P4.1
N$18
  Top 0.254: PC2.14 33.61,84.57 34.95,85.91 34.95,89.86 31.77,93.04 P4.2
N$19
  Top 0.254: PC6.6 96.63,78.42 96.63,94.11 P11.1
N$20
  Top 0.254: PC6.3 94.66,84.7 96,86.04 96,92.23 P11.2
N$21
  Top 0.254: PC3.6 42.59,76.88 44.45,78.74 44.45,92.94 P5.1
N$22
  Top 0.254: PC3.11 53.85,78.91 53.85,92.44 P6.1
N$23
  Top 0.254: PC3.14 51.39,84.79 52.83,86.23 52.83,90.95 P6.2
N$24
  Top 0.254: PC3.3 42.59,84.83 43.93,86.17 43.93,90.97 P5.2
N$25
  Top 0.254: P1.1 7.6,92.45 8.76,91.29 8.76,78.19 PC1.6
N$26
  Top 0.254: PC1.3 8.26,85.3 8.26,91.08 P1.2
N$27
  Top 0.254: PC5.14 86.95,84.66 88.27,85.98 88.27,91.08 P10.2
N$30
  Top 0.254: P10.1 87.61,92.45 88.77,91.29 88.77,78.28 PC5.11
N$33
  Top 0.254: PC4.14 70.48,85.39 70.48,91.08 P8.2
N$34
  Top 0.254: P8.1 69.83,92.45 70.99,91.29 70.99,78.28 PC4.11
P1_EN
  Top 0.254: MCP1.1 11.43,62.99 4.57,69.85 4.57,87.12 6.6,89.15 PC1.1
P1_IN1
  Top 0.254: MCP1.3 16.13,59.82 5.59,70.36 5.59,72.47 PC1.7
P1_IN2
  Top 0.254: MCP1.2 13.97,61.22 5.08,70.11 5.08,84.66 PC1.2
P2_EN
  Top 0.254: MCP1.26 15.83,68.37 PC1.9
P2_IN1
  Top 0.254: MCP1.27 13.97,72.05 PC1.10
P2_IN2
  Top 0.254: MCP1.28 11.43,82.21 PC1.15
P3_EN
  Top 0.254: MCP1.25 19.05,67.94 22.35,71.25 22.35,86.7 PC2.1
P3_IN1
  Top 0.254: MCP1.23 23.47,68.35 23.47,72.58 PC2.7
P3_IN2
  Top 0.254: MCP1.24 22.86,68.96 22.86,84.66 PC2.2
P4_EN
  Top 0.254: MCP1.21 32.9,71.37 PC2.9
P4_IN1
  Top 0.254: MCP1.22 32.9,73.91 PC2.10
P4_IN2
  Top 0.254: MCP1.5 21.59,61.21 25.37,65 25.37,68.38 32.26,75.26 32.26,85.85 33.02,86.61 PC2.15
P5_EN
  Top 0.254: MCP1.6 24.13,60.71 30.45,67.03 30.45,68.12 31.82,69.5 33.52,69.5 36.32,72.3 36.32,83.06 42.42,89.15 PC3.1
P5_IN1
  Top 0.254: MCP1.8 35.56,66.17 35.56,68.83 40.64,73.91 PC3.7
P5_IN2
  Top 0.254: MCP1.7 32.99,66.14 32.99,68.12 36.83,71.96 36.83,82.8 40.64,86.61 PC3.2
P6_EN
  Top 0.254: MCP2.3 49.53,66.17 49.53,69.51 PC3.9
P6_IN1
  Top 0.254: MCP2.2 49.02,64.14 49.02,71.55 PC3.10
P6_IN2
  Top 0.254: MCP2.1 48.26,62.36 48.26,83.48 PC3.15
P7_EN
  Top 0.254: MCP2.28 50.8,67.82 58.52,75.54 58.52,86.94 60.37,88.78 PC4.1
P7_IN1
  Top 0.254: MCP2.26 55.88,69.42 PC4.7
P7_IN2
  Top 0.254: MCP2.27 53.34,68.83 59.03,74.53 59.03,84.65 60.37,85.99 PC4.2
P8_EN
  Top 0.254: MCP2.23 67.19,71.37 PC4.9
P8_IN1
  Top 0.254: MCP2.24 67.19,73.91 PC4.10
P8_IN2
  Top 0.254: MCP2.25 67.31,76.58 67.31,84.75 PC4.15
P9_EN
  Top 0.254: MCP2.4 64.74,66.14 64.74,68.12 66.72,70.1 69.72,70.1 75.69,76.07 75.69,86.33 78.15,88.78 PC5.1
P9_IN1
  Top 0.254: MCP2.21 71.25,70.36 71.75,70.36 75.31,73.91 PC5.7
P9_IN2
  Bottom 0.254: MCP2.22 66.86,67.69 68.08,68.91 69.16,68.91 76.93,76.68 76.93,84.58 78.15,85.8 PC5.2
P10_EN
  Top 0.254: MCP2.8 74.9,66.14 74.9,68.12 76.12,69.34 84.92,69.34 PC5.9
P10_IN1
  Top 0.254: MCP2.7 72.36,66.14 72.36,68.12 74.09,69.85 82.89,69.85 PC5.10
P10_IN2
  Top 0.254: MCP2.6 69.82,66.14 69.82,68.12 71.33,69.64 72.65,69.64 75.66,72.64 80.01,72.64 85.34,77.98 85.34,86.11 85.85,86.61 PC5.15
P11_EN
  Top 0.254: PI.11 47.2,49.53 81.79,49.53 90.68,58.42 90.68,85.85 93.98,89.15 PC6.1
P11_IN1
  Top 0.254: PI.15 40.39,51.93 43.81,48.51 82.25,48.51 91.69,57.96 91.69,70.95 PC6.7
P11_IN2
  Top 0.254: PI.13 43.05,51.93 45.97,49.02 82.04,49.02 91.19,58.17 91.19,83.31 94.49,86.61 PC6.2
SCL
  Top 0.254: MCP2.12 77.34,58.42 47.75,58.42 45.09,61.09 40.64,61.09 MCP1.12 39.37,58.8 41.02,57.15 49.28,57.15 51.18,55.24 51.18,53.17 PI.5
SDA
  Top 0.254: MCP1.13 41.91,58.8 43.05,57.66 53.72,57.66 | MCP2.13 79.12,57.66 53.72,57.66 | PI.3 53.72,53.17 53.72,57.66
SHAKE1
  Top 0.254: PI.35 14.32,50.15 26.92,37.55 158.51,37.55 L1.IN1
SHAKE2
  Top 0.254: PI.33 16.86,48.38 26.96,38.27 156.74,38.27 L1.IN2
SHAKEDIR
  Bottom 0.254: PI.24 30.36,54.47 33.29,57.4 120.37,57.4 139.52,76.56 139.52,82.04 141.5,84.02 142.62,84.02 143.52,84.91 143.52,86.37 SHAKESTEP.8
SHAKEEN
  Top 0.254: PI.37 26.88,36.83 L1.ENA
SHAKESLP
  Bottom 0.254: PI.16 42.14,56.9 120.62,56.9 140.03,76.3 140.03,81.38 141.39,82.75 SHAKESTEP.6
SHAKEST
  Top 0.254: PI.21 32.26,51.93 36.69,47.5 93.98,47.5 114.85,68.37 114.85,93.73 SHAKESTOP.3
SHAKESTEP
  Bottom 0.254: PI.26 30.46,57.91 120.12,57.91 139.01,76.81 139.01,82.5 141.8,85.29 SHAKESTEP.7
SLIDEDIR
  Bottom 0.254: PI.40 10.04,54.47 11.81,56.25 16.95,56.25 18.16,55.04 18.16,51.43 19.9,49.68 128.91,49.68 156.03,76.81 156.03,84.02 SLIDESTEP.8
SLIDESLP
  Bottom 0.254: PI.36 13.05,53.2 13.05,51.47 15.85,48.67 129.33,48.67 157.05,76.39 157.05,80.11 159.68,82.75 SLIDESTEP.6
SLIDEST
  Top 0.254: PI.23 29.72,51.93 34.66,46.99 94.49,46.99 115.61,68.11 115.61,79.25 125.77,89.41 SLIDESTOP.3
SLIDESTEP
  Bottom 0.254: PI.38 12.57,54.47 13.85,55.74 14.79,55.74 15.62,54.91 15.62,51.18 17.63,49.17 129.12,49.17 156.54,76.6 156.54,81.98 SLIDESTEP.7

### Text on the board
tPlace: Robot Control Board | Rev 1.0 | Designed by Alex Prucka